# Altium project Sampling_Scope.PrjPcb (part 3 of 4)

## Sheet ECL_Fanout_X3.SchDoc
size A4; ApprovedBy: Mateusz Kowalik; CheckedBy: Mateusz Kowalik; Author: Mateusz Kowalik; CompanyName: InMotion Labs sp. z o.o.; DrawnBy: Mateusz Kowalik; Engineer: Mateusz Kowalik; Organization: InMotion Labs sp. z o.o.; Address1: Rydlówka 5A; Address2: 30-363 Kraków; Address4: Poland; DocumentNumber: 12; Revision: Rev 0; SheetNumber: 12; SheetTotal: 17
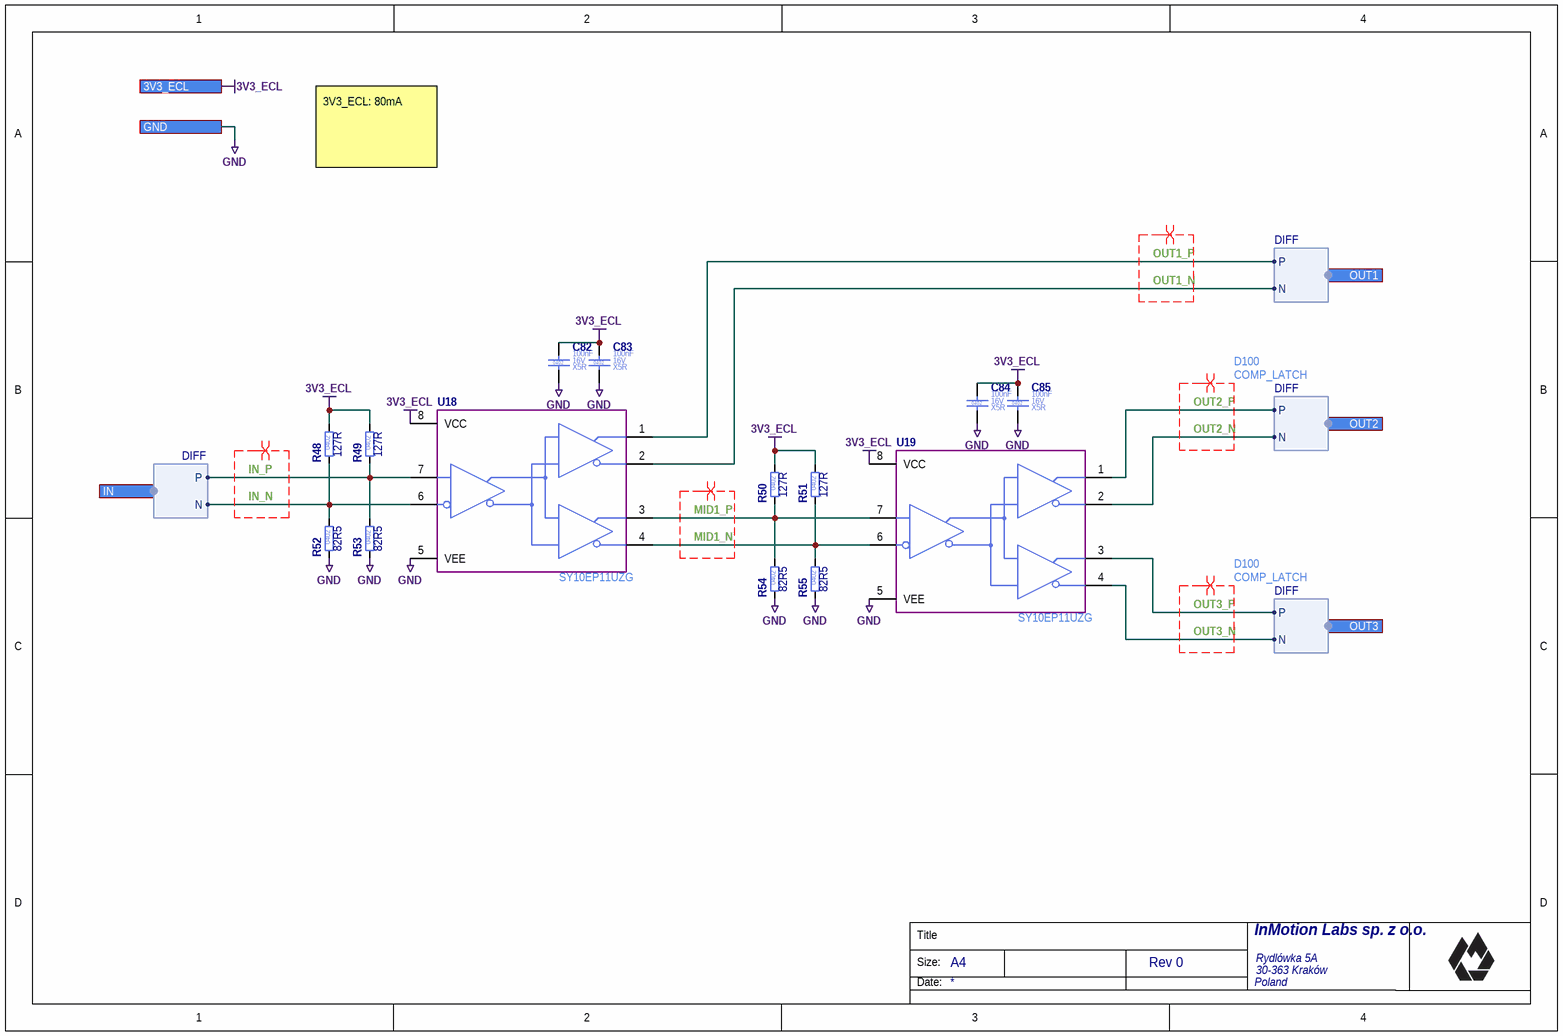
[diagram p11: ECL_Fanout_X3.SchDoc]

### Parts
C82  Case/Package: 0402  Voltage Rating (DC): 16V  Dielectric: X5R  Capacitance: 100nF  [C_0402_1005]  (hidden comment: C_100NF_16V_X5R_0402_10)
C83  Case/Package: 0402  Voltage Rating (DC): 16V  Dielectric: X5R  Capacitance: 100nF  [C_0402_1005]  (hidden comment: C_100NF_16V_X5R_0402_10)
C84  Case/Package: 0402  Voltage Rating (DC): 16V  Dielectric: X5R  Capacitance: 100nF  [C_0402_1005]  (hidden comment: C_100NF_16V_X5R_0402_10)
C85  Case/Package: 0402  Voltage Rating (DC): 16V  Dielectric: X5R  Capacitance: 100nF  [C_0402_1005]  (hidden comment: C_100NF_16V_X5R_0402_10)
R48  Resistance: 127R  Case/Package: 0402  [R_0402_1005]  (hidden comment: R_127R_0402_1)
R49  Resistance: 127R  Case/Package: 0402  [R_0402_1005]  (hidden comment: R_127R_0402_1)
R50  Resistance: 127R  Case/Package: 0402  [R_0402_1005]  (hidden comment: R_127R_0402_1)
R51  Resistance: 127R  Case/Package: 0402  [R_0402_1005]  (hidden comment: R_127R_0402_1)
R52  Resistance: 82R5  Case/Package: 0402  [R_0402_1005]  (hidden comment: R_82R5_0402_1)
R53  Resistance: 82R5  Case/Package: 0402  [R_0402_1005]  (hidden comment: R_82R5_0402_1)
R54  Resistance: 82R5  Case/Package: 0402  [R_0402_1005]  (hidden comment: R_82R5_0402_1)
R55  Resistance: 82R5  Case/Package: 0402  [R_0402_1005]  (hidden comment: R_82R5_0402_1)
U18  SY10EP11UZG  [SOIC127P600X170-8N]
U19  SY10EP11UZG  [SOIC127P600X170-8N]

### Ports
3V3_ECL, GND, IN (harness DIFF), OUT1 (harness DIFF), OUT2 (harness DIFF), OUT3 (harness DIFF)

### Harnesses
DIFF: P, N

### Nets
3V3_ECL: C82.1 C83.1 C84.1 C85.1 R48.2 R49.2 R50.2 R51.2 U18.8(VCC) U19.8(VCC) ; port 3V3_ECL
GND: C82.2 C83.2 C84.2 C85.2 R52.1 R53.1 R54.1 R55.1 U18.5(VEE) U19.5(VEE) ; port GND
IN_N: R48.1 R52.2 U18.6(~{D}) ; port IN.N  [project net DELAY_OUT1_P]
IN_P: R49.1 R53.2 U18.7(D) ; port IN.P  [project net DELAY_OUT1_N]
MID1_N: R51.1 R55.2 U18.4(~{Q1}) U19.6(~{D})  [project net MID1_N_12]
MID1_P: R50.1 R54.2 U18.3(Q1) U19.7(D)  [project net MID1_P_12]
OUT1_N: U18.2(/Q0) ; port OUT1.N
OUT1_P: U18.1(Q0) ; port OUT1.P
OUT2_N: U19.2(/Q0) ; port OUT2.N  [project net LE_N]
OUT2_P: U19.1(Q0) ; port OUT2.P  [project net LE_P]
OUT3_N: U19.4(~{Q1}) ; port OUT3.N  [project net LE_N]
OUT3_P: U19.3(Q1) ; port OUT3.P  [project net LE_P]

### Layout directives
differential pair; differential pair class D100; net class D100: IN_N, IN_P, MID1_N, MID1_P, OUT1_N, OUT1_P
differential pair; differential pair class D100; net class D100; differential pair class COMP_LATCH: OUT2_N, OUT2_P, OUT3_N, OUT3_P

### Notes on the sheet
- 3V3_ECL: 80mA
- Title
- Size:
- Date:
- A4

### Library data of the parts
C82-C85 = C_100NF_16V_X5R_0402_10: Ceramic Capacitor; Manufacturer Part Number: EMK105BJ104KV-F; Manufacturer: Taiyo Yuden; Value: 100nF; Tolerance: 10%; Part Number: C_100NF_16V_X5R_0402_10; Mount: Surface Mount; Height: 500um; HelpURL: http://datasheet.octopart.com/EMK105BJ104KV-F-Taiyo-Yuden-datasheet-8857305.pdf; RoHS: Compliant; Max Operating Temperature: 125°C; Status: MK; Supplier 1: Mouser; Supplier Part Number 1: 963-EMK105BJ104KV-F; Manufacturer 2: Samsung Electro-Mechanics; Manufacturer Part Number 2: CL05B104KO5NNNC; Supplier 2: LCSC; Supplier Part Number 2: C1525
R48-R51 = R_127R_0402_1: Thick Film Resistor; Manufacturer: Yageo; Manufacturer Part Number: RC0402FR-07127RL; Value: 127R; Tolerance: 1%; Voltage Rating (DC): 50V; Power Rating: 63mW; Stats: MK; Part Number: R_127R_0402_1; Mount: Surface Mount; Height: 350um; HelpURL: https://pl.mouser.com/datasheet/2/447/PYu_RC_Group_51_RoHS_L_10-1664068.pdf; RoHS: Compliant; Max Operating Temperature: 155°C; Supplier 1: Mouser; Supplier Part Number 1: 603-RC0402FR-07127RL; Manufacturer 2: Uniroyal Elec; Manufacturer Part Number 2: 0402WGF1270TCE; Supplier 2: LCSC; Supplier Part Number 2: C247127
R52-R55 = R_82R5_0402_1: Thick Film Resistor; Manufacturer: Yageo; Manufacturer Part Number: RC0402FR-0782R5L; Value: 82R5; Tolerance: 1%; Voltage Rating (DC): 50V; Power Rating: 63mW; Stats: MK; Part Number: R_82R5_0402_1; Mount: Surface Mount; Height: 350um; HelpURL: https://pl.mouser.com/datasheet/2/447/PYu-RC_Group_51_RoHS_L_10-1527934.pdf; RoHS: Compliant; Max Operating Temperature: 155°C; Supplier 1: Mouser; Supplier Part Number 1: 603-RC0402FR-0782R5L; Manufacturer 2: Uniroyal Elec; Manufacturer Part Number 2: 0402WGF825JTCE; Supplier 2: LCSC; Supplier Part Number 2: C52037
U18 U19 = SY10EP11UZG: 1:2 PECL Fanout Buffer; Manufacturer: Microchip; Max Output Current: 100mA; Marking: Z8-1; Max Supply Voltage: 3.6V; Min Supply Voltage: 3.0V; Part Number: SY10EP11UZG; Case/Package: SOIC8; Mount: Surface Mount; Height: 1.75mm; HelpURL: https://datasheet.octopart.com/SY10EP11UZG-Microchip-datasheet-39498.pdf; Max Operating Temperature: 85°C; RoHS: Compliant; Status: MK; Manufacturer Part Number: SY10EP11UZG; Supplier 1: Mouser; Supplier Part Number 1: 998-SY10EP11UZG

## Sheet Step_Gen.SchDoc
size A4; ApprovedBy: Mateusz Kowalik; CheckedBy: Mateusz Kowalik; Author: Mateusz Kowalik; CompanyName: InMotion Labs sp. z o.o.; DrawnBy: Mateusz Kowalik; Engineer: Mateusz Kowalik; Organization: InMotion Labs sp. z o.o.; Address1: Rydlówka 5A; Address2: 30-363 Kraków; Address4: Poland; DocumentNumber: 9; Revision: Rev 0; SheetNumber: 8; SheetTotal: 17
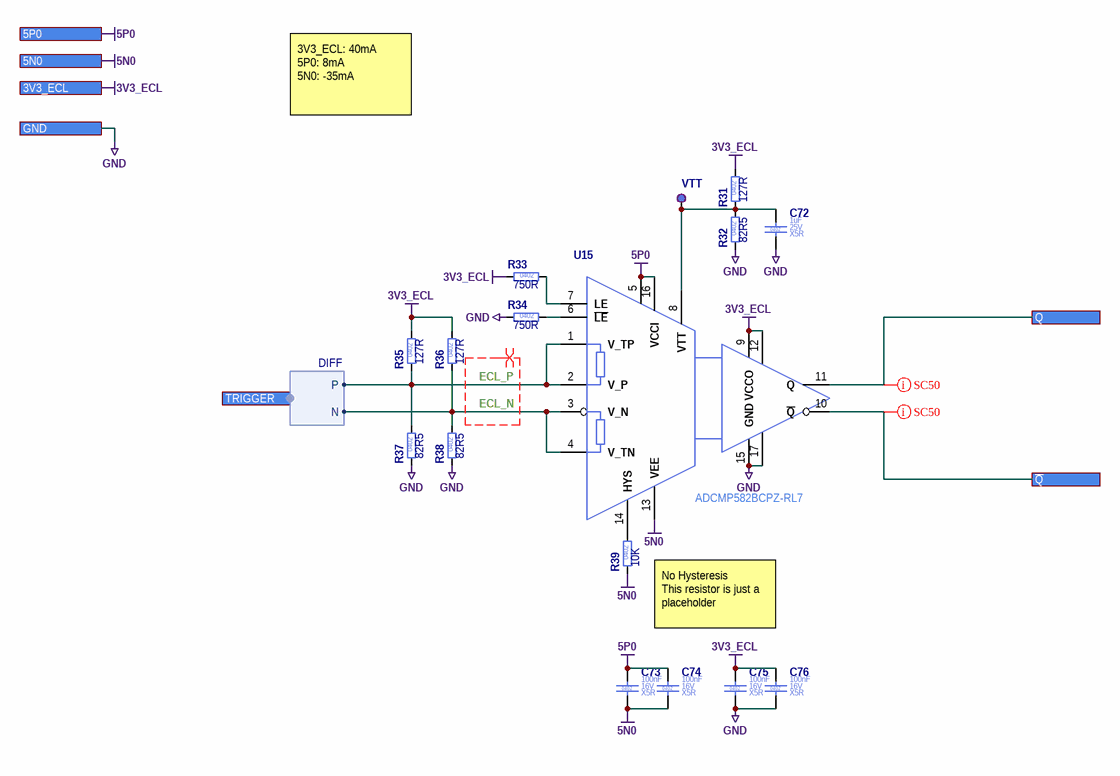
[diagram p12: Step_Gen.SchDoc]

### Parts
C72  Case/Package: 0402  Voltage Rating (DC): 25V  Dielectric: X5R  Capacitance: 1uF  [C_0402_1005]  (hidden comment: C_1UF_25V_X5R_0402_10)
C73  Case/Package: 0402  Voltage Rating (DC): 16V  Dielectric: X5R  Capacitance: 100nF  [C_0402_1005]  (hidden comment: C_100NF_16V_X5R_0402_10)
C74  Case/Package: 0402  Voltage Rating (DC): 16V  Dielectric: X5R  Capacitance: 100nF  [C_0402_1005]  (hidden comment: C_100NF_16V_X5R_0402_10)
C75  Case/Package: 0402  Voltage Rating (DC): 16V  Dielectric: X5R  Capacitance: 100nF  [C_0402_1005]  (hidden comment: C_100NF_16V_X5R_0402_10)
C76  Case/Package: 0402  Voltage Rating (DC): 16V  Dielectric: X5R  Capacitance: 100nF  [C_0402_1005]  (hidden comment: C_100NF_16V_X5R_0402_10)
R31  Resistance: 127R  Case/Package: 0402  [R_0402_1005]  (hidden comment: R_127R_0402_1)
R32  Resistance: 82R5  Case/Package: 0402  [R_0402_1005]  (hidden comment: R_82R5_0402_1)
R33  Resistance: 750R  Case/Package: 0402  [R_0402_1005]  (hidden comment: R_750R_0402_1)
R34  Resistance: 750R  Case/Package: 0402  [R_0402_1005]  (hidden comment: R_750R_0402_1)
R35  Resistance: 127R  Case/Package: 0402  [R_0402_1005]  (hidden comment: R_127R_0402_1)
R36  Resistance: 127R  Case/Package: 0402  [R_0402_1005]  (hidden comment: R_127R_0402_1)
R37  Resistance: 82R5  Case/Package: 0402  [R_0402_1005]  (hidden comment: R_82R5_0402_1)
R38  Resistance: 82R5  Case/Package: 0402  [R_0402_1005]  (hidden comment: R_82R5_0402_1)
R39  Resistance: 10K  Case/Package: 0402  [R_0402_1005]  (hidden comment: R_10K_0402_1)
U15  ADCMP582BCPZ-RL7  [QFN50P300X300X100_HS-17N]
VTT  TP_PAD_1.3MM  [TP_PAD_1.3MM]  (value not drawn)  (no BOM)

### Ports
3V3_ECL, 5N0, 5P0, GND, Q, TRIGGER (harness DIFF), ~{Q}

### Harnesses
DIFF: P, N

### Nets
3V3_ECL: C75.1 C76.1 R31.2 R33.1 R35.2 R36.2 U15.9(VCCO) U15.12(VCCO) ; port 3V3_ECL
5N0: C73.2 C74.2 R39.1 U15.13(VEE) ; port 5N0
5P0: C73.1 C74.1 U15.5(VCCI) U15.16(VCCI) ; port 5P0
GND: C72.2 C75.2 C76.2 R32.1 R34.1 R37.1 R38.1 U15.15(GND) U15.17(GND) ; port GND
ECL_N: R36.1 R38.2 U15.3(V_N) U15.4(V_TN) ; port TRIGGER.N  [project net DELAY_OUT1_N]
ECL_P: R35.1 R37.2 U15.1(V_TP) U15.2(V_P) ; port TRIGGER.P  [project net DELAY_OUT1_P]
STEP_GEN_FEED_N: U15.10(~{Q}) ; port ~{Q}
STEP_GEN_FEED_P: U15.11(Q) ; port Q
NetC72_1: C72.1 R31.1 R32.2 U15.8(VTT) VTT.1(TP)
NetR33_2: R33.2 U15.7(LE)
NetR34_2: R34.2 U15.6(~{LE})
NetR39_2: R39.2 U15.14(HYS)

### Layout directives
net class SC50: STEP_GEN_FEED_N, STEP_GEN_FEED_P
differential pair; differential pair class D100; net class D100: ECL_N, ECL_P

### Notes on the sheet
- 3V3_ECL: 40mA
  5P0: 8mA
  5N0: -35mA
- (near R39) No Hysteresis
  This resistor is just a placeholder
- Title
- Size:
- Date:
- A4

### Library data of the parts
C72 = C_1UF_25V_X5R_0402_10: Ceramic Capacitor; Manufacturer Part Number: CL05A105KA5NQNC; Manufacturer: Samsung Electro-Mechanics; Value: 1uF; Tolerance: 10%; Part Number: C_1UF_25V_X5R_0402_10; Mount: Surface Mount; Height: 550um; HelpURL: https://pl.mouser.com/datasheet/2/585/MLCC-1837944.pdf; RoHS: Compliant; Max Operating Temperature: 85°C; Status: MK; Supplier 1: Mouser; Supplier Part Number 1: 187-CL05A105KA5NQNC; Manufacturer 2: Samsung Electro-Mechanics; Manufacturer Part Number 2: CL05A105KA5NQNC; Supplier 2: LCSC; Supplier Part Number 2: C52923
C73-C76 = C_100NF_16V_X5R_0402_10: as C82 on sheet ECL_Fanout_X3; Part Number: C_100NF_16V_X5R_0402_10; Mount: Surface Mount; Height: 500um; HelpURL: http://datasheet.octopart.com/EMK105BJ104KV-F-Taiyo-Yuden-datasheet-8857305.pdf; RoHS: Compliant; Max Operating Temperature: 125°C; Status: MK; Supplier 1: Mouser; Supplier Part Number 1: 963-EMK105BJ104KV-F; Manufacturer 2: Samsung Electro-Mechanics; Manufacturer Part Number 2: CL05B104KO5NNNC; Supplier 2: LCSC; Supplier Part Number 2: C1525
R31 R35 R36 = R_127R_0402_1: as R48 on sheet ECL_Fanout_X3; Part Number: R_127R_0402_1; Mount: Surface Mount; Height: 350um; HelpURL: https://pl.mouser.com/datasheet/2/447/PYu_RC_Group_51_RoHS_L_10-1664068.pdf; RoHS: Compliant; Max Operating Temperature: 155°C; Supplier 1: Mouser; Supplier Part Number 1: 603-RC0402FR-07127RL; Manufacturer 2: Uniroyal Elec; Manufacturer Part Number 2: 0402WGF1270TCE; Supplier 2: LCSC; Supplier Part Number 2: C247127
R32 R37 R38 = R_82R5_0402_1: as R52 on sheet ECL_Fanout_X3; Part Number: R_82R5_0402_1; Mount: Surface Mount; Height: 350um; HelpURL: https://pl.mouser.com/datasheet/2/447/PYu-RC_Group_51_RoHS_L_10-1527934.pdf; RoHS: Compliant; Max Operating Temperature: 155°C; Supplier 1: Mouser; Supplier Part Number 1: 603-RC0402FR-0782R5L; Manufacturer 2: Uniroyal Elec; Manufacturer Part Number 2: 0402WGF825JTCE; Supplier 2: LCSC; Supplier Part Number 2: C52037
R33 R34 = R_750R_0402_1: Thick Film Resistor; Manufacturer: Yageo; Manufacturer Part Number: RC0402FR-07750RL; Value: 750R; Tolerance: 1%; Voltage Rating (DC): 50V; Power Rating: 63mW; Stats: MK; Part Number: R_750R_0402_1; Mount: Surface Mount; Height: 350um; HelpURL: https://pl.mouser.com/datasheet/2/447/PYu-RC_Group_51_RoHS_L_10-1664068.pdf; RoHS: Compliant; Max Operating Temperature: 155°C; Supplier 1: Mouser; Supplier Part Number 1: 603-RC0402FR-07750RL; Manufacturer 2: Uniroyal Elec; Manufacturer Part Number 2: 0402WGF7500TCE; Supplier 2: LCSC; Supplier Part Number 2: C25132
R39 = R_10K_0402_1: Thick Film Resistor; Manufacturer: Yageo; Manufacturer Part Number: RC0402FR-7W10KL; Value: 10K; Tolerance: 1%; Voltage Rating (DC): 50V; Power Rating: 63mW; Stats: MK; Part Number: R_10K_0402_1; Mount: Surface Mount; Height: 350um; HelpURL: https://pl.mouser.com/datasheet/2/447/PYu-RC_Group_51_RoHS_L_10-1664068.pdf; RoHS: Compliant; Max Operating Temperature: 155°C; Supplier 1: Mouser; Supplier Part Number 1: 603-RC0402FR-7W10KL; Manufacturer 2: Uniroyal Elec; Manufacturer Part Number 2: 0402WGF1002TCE; Supplier 2: LCSC; Supplier Part Number 2: C25744
U15 = ADCMP582BCPZ-RL7: Single Comparator; Manufacturer: Analog Devices; Number of Comparators: 1; Response Time: 180ps; Input Offset Voltage: 4mV; Marking: G10; Max Supply Voltage: 5.5V; Min Supply Voltage: 4.5V; Part Number: ADCMP582BCPZ-RL7; Manufacturer Part Number: ADCMP582BCPZ-RL7; Case/Package: QFN14; Mount: Surface Mount; Height: 0.8mm; Max Operating Temperature: 125; HelpURL: https://www.analog.com/media/en/technical-documentation/data-sheets/ADCMP580_581_582.pdf; Number of Pins: 16; RoHS: Compliant
VTT = TP_PAD_1.3MM: Testpoint SMD 1.3mm; Part Number: TP_PAD_1.3MM; Case/Package: SMD; Length: 0mm

## Sheet CMOS_MUX.SchDoc
size A4; ApprovedBy: Mateusz Kowalik; CheckedBy: Mateusz Kowalik; Author: Mateusz Kowalik; CompanyName: InMotion Labs sp. z o.o.; DrawnBy: Mateusz Kowalik; Engineer: Mateusz Kowalik; Organization: InMotion Labs sp. z o.o.; Address1: Rydlówka 5A; Address2: 30-363 Kraków; Address4: Poland; DocumentNumber: 13; Revision: Rev 0; SheetNumber: 13; SheetTotal: 17
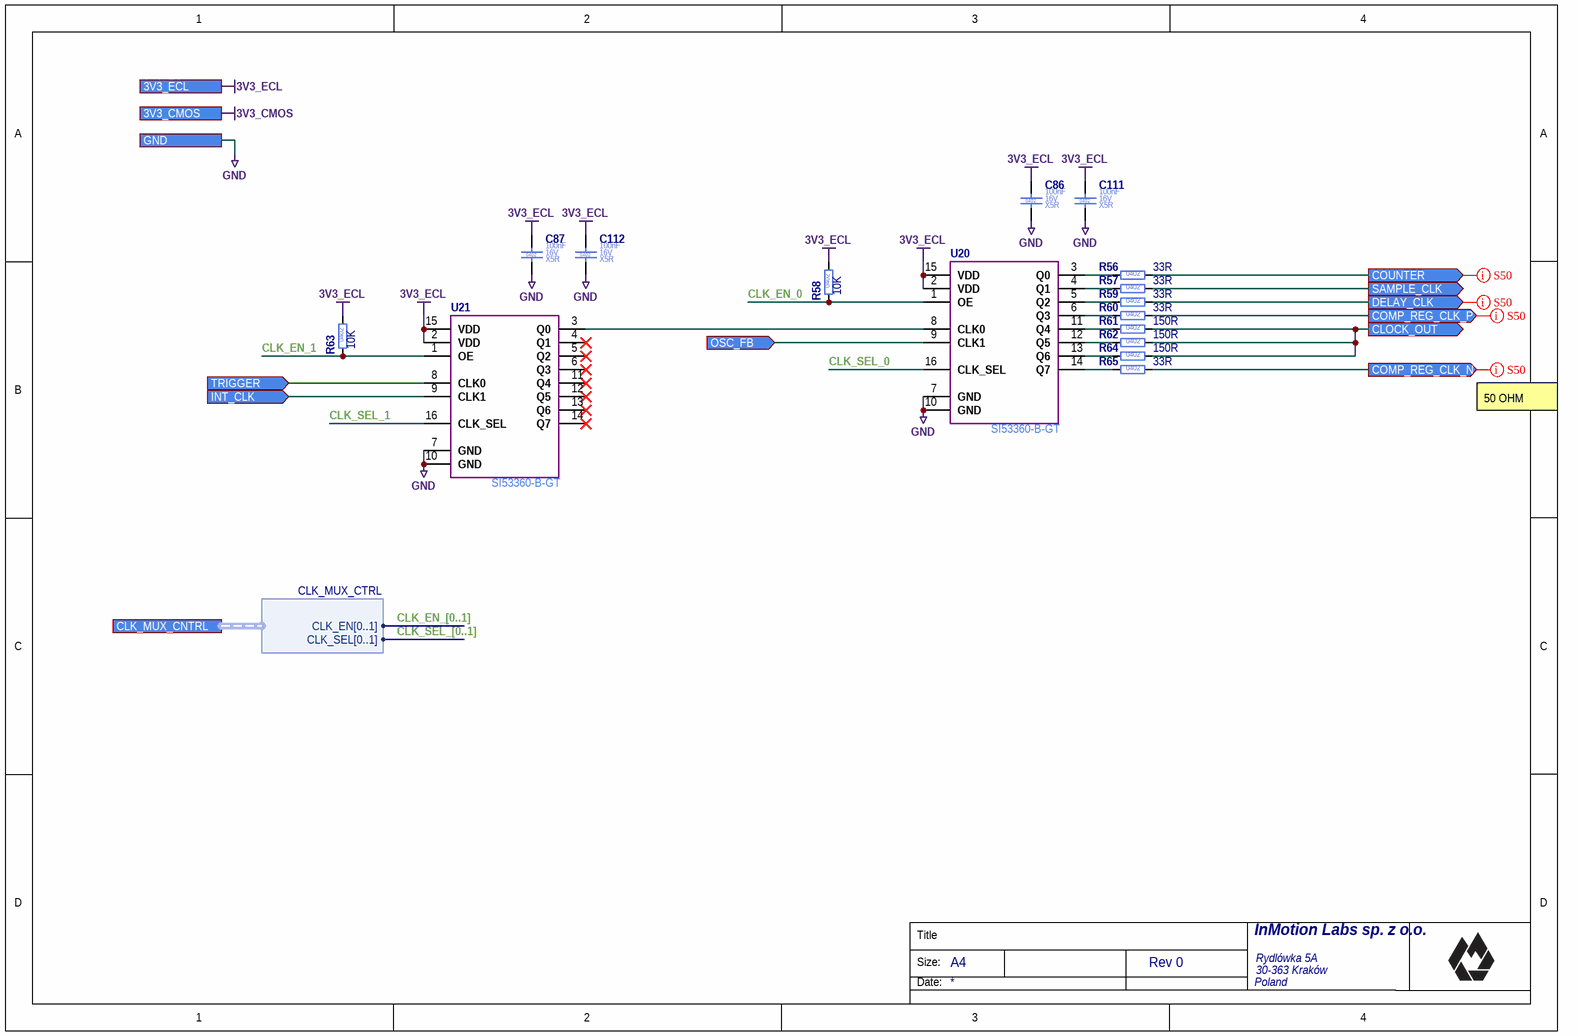
[diagram p13: CMOS_MUX.SchDoc]

### Parts
C86  Case/Package: 0402  Voltage Rating (DC): 16V  Dielectric: X5R  Capacitance: 100nF  [C_0402_1005]  (hidden comment: C_100NF_16V_X5R_0402_10)
C87  Case/Package: 0402  Voltage Rating (DC): 16V  Dielectric: X5R  Capacitance: 100nF  [C_0402_1005]  (hidden comment: C_100NF_16V_X5R_0402_10)
C111  Case/Package: 0402  Voltage Rating (DC): 16V  Dielectric: X5R  Capacitance: 100nF  [C_0402_1005]  (hidden comment: C_100NF_16V_X5R_0402_10)
C112  Case/Package: 0402  Voltage Rating (DC): 16V  Dielectric: X5R  Capacitance: 100nF  [C_0402_1005]  (hidden comment: C_100NF_16V_X5R_0402_10)
R56  Resistance: 33R  Case/Package: 0402  [R_0402_1005]  (hidden comment: R_33R_0402_1)
R57  Resistance: 33R  Case/Package: 0402  [R_0402_1005]  (hidden comment: R_33R_0402_1)
R58  Resistance: 10K  Case/Package: 0402  [R_0402_1005]  (hidden comment: R_10K_0402_1)
R59  Resistance: 33R  Case/Package: 0402  [R_0402_1005]  (hidden comment: R_33R_0402_1)
R60  Resistance: 33R  Case/Package: 0402  [R_0402_1005]  (hidden comment: R_33R_0402_1)
R61  Resistance: 150R  Case/Package: 0402  [R_0402_1005]  (hidden comment: R_150R_0402_1)
R62  Resistance: 150R  Case/Package: 0402  [R_0402_1005]  (hidden comment: R_150R_0402_1)
R63  Resistance: 10K  Case/Package: 0402  [R_0402_1005]  (hidden comment: R_10K_0402_1)
R64  Resistance: 150R  Case/Package: 0402  [R_0402_1005]  (hidden comment: R_150R_0402_1)
R65  Resistance: 33R  Case/Package: 0402  [R_0402_1005]  (hidden comment: R_33R_0402_1)
U20  Si53360-B-GT  [TSOP65P640X120-16N]
U21  Si53360-B-GT  [TSOP65P640X120-16N]

### Ports
3V3_CMOS, 3V3_ECL, CLK_MUX_CNTRL (harness CLK_MUX_CTRL), CLOCK_OUT (out), COMP_REG_CLK_N (out), COMP_REG_CLK_P (out), COUNTER (out), DELAY_CLK (out), GND, INT_CLK (in), OSC_FB (in), SAMPLE_CLK (out), TRIGGER (in)

### Harnesses
CLK_MUX_CTRL: CLK_SEL[0..1], CLK_EN[0..1]

### Nets
3V3_ECL: C86.1 C87.1 C111.1 C112.1 R58.2 R63.2 U20.2(VDD) U20.15(VDD) U21.2(VDD) U21.15(VDD) ; port 3V3_ECL
GND: C86.2 C87.2 C111.2 C112.2 U20.7(GND) U20.10(GND) U21.7(GND) U21.10(GND) ; port GND
CLK_EN_0: R58.1 U20.1(OE)
CLK_EN_1: R63.1 U21.1(OE)
CLK_OUT: R61.2 R62.2 R64.2 ; port CLOCK_OUT
CLK_SEL_0: U20.16(CLK_SEL)
CLK_SEL_1: U21.16(CLK_SEL)
COMP_REG_CLK_N: R65.2 ; port COMP_REG_CLK_N
COMP_REG_CLK_P: R60.2 ; port COMP_REG_CLK_P
COUNTER: R56.2 ; port COUNTER
DELAY_CLK: R59.2 ; port DELAY_CLK
INT_CLK: U21.9(CLK1) ; port INT_CLK
OSC_FB: U20.9(CLK1) ; port OSC_FB
SAMPLE_CLK: R57.2 ; port SAMPLE_CLK
TRIGGER_IN: U21.8(CLK0) ; port TRIGGER
NetR56_1: R56.1 U20.3(Q0)
NetR57_1: R57.1 U20.4(Q1)
NetR59_1: R59.1 U20.5(Q2)
NetR60_1: R60.1 U20.6(Q3)
NetR61_1: R61.1 U20.11(Q4)
NetR62_1: R62.1 U20.12(Q5)
NetR64_1: R64.1 U20.13(Q6)
NetR65_1: R65.1 U20.14(Q7)
NetU20_8: U20.8(CLK0) U21.3(Q0)

Not connected (* = marked no-connect by the designer): U21 4(Q1)* 5(Q2)* 6(Q3)* 11(Q4)* 12(Q5)* 13(Q6)* 14(Q7)*

### Buses and harness runs
bus CLK_EN_[0..1]
bus CLK_SEL_[0..1]

### Layout directives
net class S50: COMP_REG_CLK_N, COMP_REG_CLK_P, COUNTER, DELAY_CLK

### Notes on the sheet
- 50 OHM
- Title
- Size:
- Date:
- A4

### Library data of the parts
C86 C87 C111 C112 = C_100NF_16V_X5R_0402_10: as C82 on sheet ECL_Fanout_X3; Part Number: C_100NF_16V_X5R_0402_10; Mount: Surface Mount; Height: 500um; HelpURL: http://datasheet.octopart.com/EMK105BJ104KV-F-Taiyo-Yuden-datasheet-8857305.pdf; RoHS: Compliant; Max Operating Temperature: 125°C; Status: MK; Supplier 1: Mouser; Supplier Part Number 1: 963-EMK105BJ104KV-F; Manufacturer 2: Samsung Electro-Mechanics; Manufacturer Part Number 2: CL05B104KO5NNNC; Supplier 2: LCSC; Supplier Part Number 2: C1525
R56 R57 R59 R60 R65 = R_33R_0402_1: Thick Film Resistor; Manufacturer: Yageo; Manufacturer Part Number: RC0402FR-0733RL; Value: 33R; Tolerance: 1%; Voltage Rating (DC): 50V; Power Rating: 63mW; Stats: MK; Part Number: R_33R_0402_1; Mount: Surface Mount; Height: 350um; HelpURL: https://pl.mouser.com/datasheet/2/447/PYu-RC_Group_51_RoHS_L_10-1527934.pdf; RoHS: Compliant; Max Operating Temperature: 155°C; Supplier 1: Mouser; Supplier Part Number 1: 603-RC0402FR-0733RL; Manufacturer 2: Uniroyal Elec; Manufacturer Part Number 2: 0402WGF330JTCE; Supplier 2: LCSC; Supplier Part Number 2: C25105
R58 R63 = R_10K_0402_1: as R39 on sheet Step_Gen; Part Number: R_10K_0402_1; Mount: Surface Mount; Height: 350um; HelpURL: https://pl.mouser.com/datasheet/2/447/PYu-RC_Group_51_RoHS_L_10-1664068.pdf; RoHS: Compliant; Max Operating Temperature: 155°C; Supplier 1: Mouser; Supplier Part Number 1: 603-RC0402FR-7W10KL; Manufacturer 2: Uniroyal Elec; Manufacturer Part Number 2: 0402WGF1002TCE; Supplier 2: LCSC; Supplier Part Number 2: C25744
R61 R62 R64 = R_150R_0402_1: Thick Film Resistor; Manufacturer: Yageo; Manufacturer Part Number: RC0402FR-07150RL; Value: 150R; Tolerance: 1%; Voltage Rating (DC): 50V; Power Rating: 63mW; Stats: MK; Part Number: R_150R_0402_1; Mount: Surface Mount; Height: 350um; HelpURL: http://datasheet.octopart.com/RC0402FR-07150RL-Yageo-datasheet-10408619.pdf; RoHS: Compliant; Max Operating Temperature: 155°C; Supplier 1: Mouser; Supplier Part Number 1: 603-RC0402FR-07150RL; Manufacturer 2: Uniroyal Elec; Manufacturer Part Number 2: 0402WGF1500TCE; Supplier 2: LCSC; Supplier Part Number 2: C25082
U20 U21 = Si53360-B-GT: Low Jitter Clock Buffer; Manufacturer: Silicon Labs; Max Frequency: 200MHz; Max Supply Voltage: 3.6V; Min Supply Voltage: 2.25V; Part Number: Si53360-B-GT; Case/Package: TSSOP16; Mount: Surface Mount; Height: 1.2mm; HelpURL: https://pl.mouser.com/datasheet/2/368/Si5336x-datasheet-1397964.pdf; Logic Function: Clock Buffer; Marking: Si53360; Max Operating Temperature: 85°C; RoHS: Compliant; Status: MK; Manufacturer Part Number: SI53360-B-GT; Supplier 1: Mouser; Supplier Part Number 1: 634-SI53360-B-GT

## Sheet Counter.SchDoc
size A4; ApprovedBy: Mateusz Kowalik; CheckedBy: Mateusz Kowalik; Author: Mateusz Kowalik; CompanyName: InMotion Labs sp. z o.o.; DrawnBy: Mateusz Kowalik; Engineer: Mateusz Kowalik; Organization: InMotion Labs sp. z o.o.; Address1: Rydlówka 5A; Address2: 30-363 Kraków; Address4: Poland; DocumentNumber: 14; Revision: Rev 0; SheetNumber: 14; SheetTotal: 17
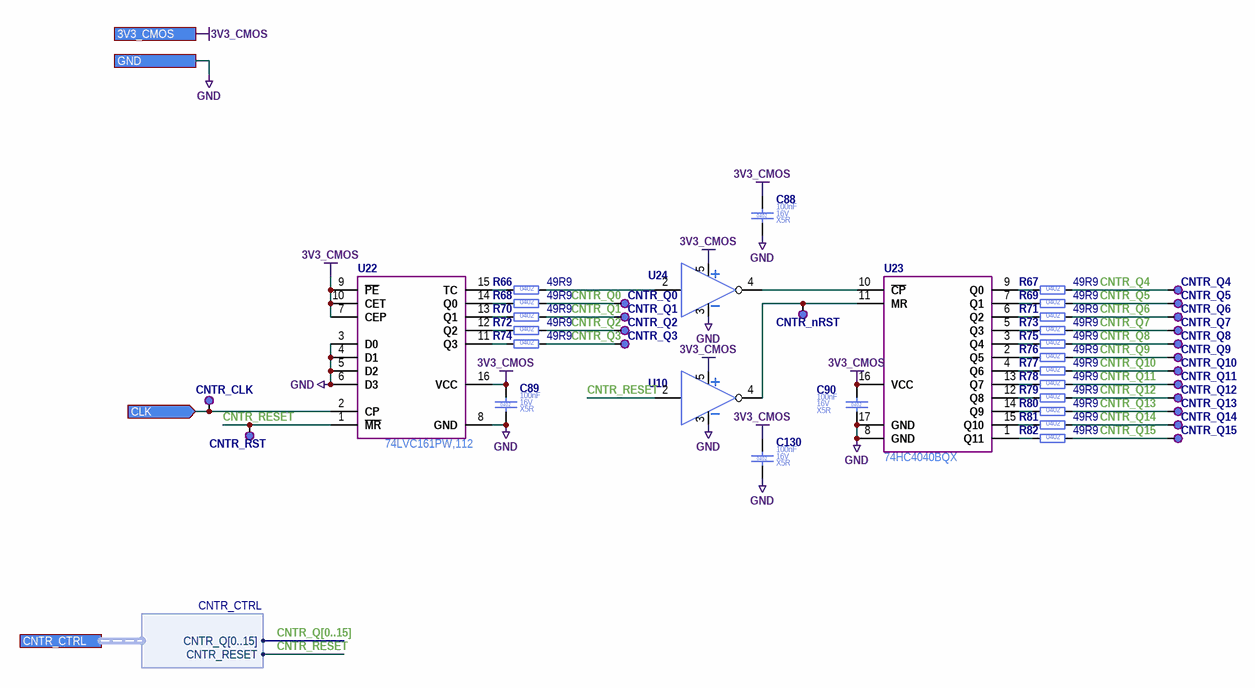
[diagram p14: Counter.SchDoc]

### Parts
C88  Case/Package: 0402  Voltage Rating (DC): 16V  Dielectric: X5R  Capacitance: 100nF  [C_0402_1005]  (hidden comment: C_100NF_16V_X5R_0402_10)
C89  Case/Package: 0402  Voltage Rating (DC): 16V  Dielectric: X5R  Capacitance: 100nF  [C_0402_1005]  (hidden comment: C_100NF_16V_X5R_0402_10)
C90  Case/Package: 0402  Voltage Rating (DC): 16V  Dielectric: X5R  Capacitance: 100nF  [C_0402_1005]  (hidden comment: C_100NF_16V_X5R_0402_10)
C130  Case/Package: 0402  Voltage Rating (DC): 16V  Dielectric: X5R  Capacitance: 100nF  [C_0402_1005]  (hidden comment: C_100NF_16V_X5R_0402_10)
CNTR_CLK  TP_PAD_1.3MM  [TP_PAD_1.3MM]  (value not drawn)  (no BOM)
CNTR_nRST  TP_PAD_1.3MM  [TP_PAD_1.3MM]  (value not drawn)  (no BOM)
CNTR_Q0  TP_PAD_1.3MM  [TP_PAD_1.3MM]  (value not drawn)  (no BOM)
CNTR_Q1  TP_PAD_1.3MM  [TP_PAD_1.3MM]  (value not drawn)  (no BOM)
CNTR_Q2  TP_PAD_1.3MM  [TP_PAD_1.3MM]  (value not drawn)  (no BOM)
CNTR_Q3  TP_PAD_1.3MM  [TP_PAD_1.3MM]  (value not drawn)  (no BOM)
CNTR_Q4  TP_PAD_1.3MM  [TP_PAD_1.3MM]  (value not drawn)  (no BOM)
CNTR_Q5  TP_PAD_1.3MM  [TP_PAD_1.3MM]  (value not drawn)  (no BOM)
CNTR_Q6  TP_PAD_1.3MM  [TP_PAD_1.3MM]  (value not drawn)  (no BOM)
CNTR_Q7  TP_PAD_1.3MM  [TP_PAD_1.3MM]  (value not drawn)  (no BOM)
CNTR_Q8  TP_PAD_1.3MM  [TP_PAD_1.3MM]  (value not drawn)  (no BOM)
CNTR_Q9  TP_PAD_1.3MM  [TP_PAD_1.3MM]  (value not drawn)  (no BOM)
CNTR_Q10  TP_PAD_1.3MM  [TP_PAD_1.3MM]  (value not drawn)  (no BOM)
CNTR_Q11  TP_PAD_1.3MM  [TP_PAD_1.3MM]  (value not drawn)  (no BOM)
CNTR_Q12  TP_PAD_1.3MM  [TP_PAD_1.3MM]  (value not drawn)  (no BOM)
CNTR_Q13  TP_PAD_1.3MM  [TP_PAD_1.3MM]  (value not drawn)  (no BOM)
CNTR_Q14  TP_PAD_1.3MM  [TP_PAD_1.3MM]  (value not drawn)  (no BOM)
CNTR_Q15  TP_PAD_1.3MM  [TP_PAD_1.3MM]  (value not drawn)  (no BOM)
CNTR_RST  TP_PAD_1.3MM  [TP_PAD_1.3MM]  (value not drawn)  (no BOM)
R66  Resistance: 49R9  Case/Package: 0402  [R_0402_1005]  (hidden comment: R_49R9_0402_1)
R67  Resistance: 49R9  Case/Package: 0402  [R_0402_1005]  (hidden comment: R_49R9_0402_1)
R68  Resistance: 49R9  Case/Package: 0402  [R_0402_1005]  (hidden comment: R_49R9_0402_1)
R69  Resistance: 49R9  Case/Package: 0402  [R_0402_1005]  (hidden comment: R_49R9_0402_1)
R70  Resistance: 49R9  Case/Package: 0402  [R_0402_1005]  (hidden comment: R_49R9_0402_1)
R71  Resistance: 49R9  Case/Package: 0402  [R_0402_1005]  (hidden comment: R_49R9_0402_1)
R72  Resistance: 49R9  Case/Package: 0402  [R_0402_1005]  (hidden comment: R_49R9_0402_1)
R73  Resistance: 49R9  Case/Package: 0402  [R_0402_1005]  (hidden comment: R_49R9_0402_1)
R74  Resistance: 49R9  Case/Package: 0402  [R_0402_1005]  (hidden comment: R_49R9_0402_1)
R75  Resistance: 49R9  Case/Package: 0402  [R_0402_1005]  (hidden comment: R_49R9_0402_1)
R76  Resistance: 49R9  Case/Package: 0402  [R_0402_1005]  (hidden comment: R_49R9_0402_1)
R77  Resistance: 49R9  Case/Package: 0402  [R_0402_1005]  (hidden comment: R_49R9_0402_1)
R78  Resistance: 49R9  Case/Package: 0402  [R_0402_1005]  (hidden comment: R_49R9_0402_1)
R79  Resistance: 49R9  Case/Package: 0402  [R_0402_1005]  (hidden comment: R_49R9_0402_1)
R80  Resistance: 49R9  Case/Package: 0402  [R_0402_1005]  (hidden comment: R_49R9_0402_1)
R81  Resistance: 49R9  Case/Package: 0402  [R_0402_1005]  (hidden comment: R_49R9_0402_1)
R82  Resistance: 49R9  Case/Package: 0402  [R_0402_1005]  (hidden comment: R_49R9_0402_1)
U10  SN74AHC1G04DBVR  [SOT23-5_SC74A_SOT753_M]  (value not drawn)
U22  74LVC161PW,112  [TSOP65P640X120-16N]
U23  74HC4040BQX  [QFN50P350X250X100_HS-17N]
U24  SN74AHC1G04DBVR  [SOT23-5_SC74A_SOT753_M]  (value not drawn)

### Ports
3V3_CMOS, CLK (in), CNTR_CTRL (harness CNTR_CTRL), GND

### Harnesses
CNTR_CTRL: CNTR_Q[0..15], CNTR_RESET

### Nets
3V3_CMOS: C88.1 C89.1 C90.1 C130.1 U10.5(VCC) U22.7(CEP) U22.9(~{PE}) U22.10(CET) U22.16(VCC) U23.16(VCC) U24.5(VCC) ; port 3V3_CMOS
GND: C88.2 C89.2 C90.2 C130.2 U10.3(GND) U22.3(D0) U22.4(D1) U22.5(D2) U22.6(D3) U22.8(GND) U23.8(GND) U23.17(GND) U24.3(GND) ; port GND
CNTR_Q0: CNTR_Q0.1(TP) R68.2
CNTR_Q1: CNTR_Q1.1(TP) R70.2
CNTR_Q2: CNTR_Q2.1(TP) R72.2
CNTR_Q3: CNTR_Q3.1(TP) R74.2
CNTR_Q4: CNTR_Q4.1(TP) R67.2
CNTR_Q5: CNTR_Q5.1(TP) R69.2
CNTR_Q6: CNTR_Q6.1(TP) R71.2
CNTR_Q7: CNTR_Q7.1(TP) R73.2
CNTR_Q8: CNTR_Q8.1(TP) R75.2
CNTR_Q9: CNTR_Q9.1(TP) R76.2
CNTR_Q10: CNTR_Q10.1(TP) R77.2
CNTR_Q11: CNTR_Q11.1(TP) R78.2
CNTR_Q12: CNTR_Q12.1(TP) R79.2
CNTR_Q13: CNTR_Q13.1(TP) R80.2
CNTR_Q14: CNTR_Q14.1(TP) R81.2
CNTR_Q15: CNTR_Q15.1(TP) R82.2
CNTR_RESET: CNTR_RST.1(TP) U10.2 U22.1(~{MR}) ; port CNTR_CTRL.CNTR_RESET  [project net CNTR_CTRL.CNTR_RESET]
COUNTER: CNTR_CLK.1(TP) U22.2(CP) ; port CLK
NetCNTR_nRST_1: CNTR_nRST.1(TP) U10.4(OutY) U23.11(MR)
NetR66_1: R66.1 U22.15(TC)
NetR66_2: R66.2 U24.2
NetR67_1: R67.1 U23.9(Q0)
NetR68_1: R68.1 U22.14(Q0)
NetR69_1: R69.1 U23.7(Q1)
NetR70_1: R70.1 U22.13(Q1)
NetR71_1: R71.1 U23.6(Q2)
NetR72_1: R72.1 U22.12(Q2)
NetR73_1: R73.1 U23.5(Q3)
NetR74_1: R74.1 U22.11(Q3)
NetR75_1: R75.1 U23.3(Q4)
NetR76_1: R76.1 U23.2(Q5)
NetR77_1: R77.1 U23.4(Q6)
NetR78_1: R78.1 U23.13(Q7)
NetR79_1: R79.1 U23.12(Q8)
NetR80_1: R80.1 U23.14(Q9)
NetR81_1: R81.1 U23.15(Q10)
NetR82_1: R82.1 U23.1(Q11)
NetU23_10: U23.10(~{CP}) U24.4(OutY)

Not connected (* = marked no-connect by the designer): U10 1(NC); U24 1(NC)

### Buses and harness runs
bus CNTR_Q[0..15]

### Notes on the sheet
- Title
- Size:
- Date:
- A4

### Library data of the parts
C88-C90 C130 = C_100NF_16V_X5R_0402_10: as C82 on sheet ECL_Fanout_X3; Part Number: C_100NF_16V_X5R_0402_10; Mount: Surface Mount; Height: 500um; HelpURL: http://datasheet.octopart.com/EMK105BJ104KV-F-Taiyo-Yuden-datasheet-8857305.pdf; RoHS: Compliant; Max Operating Temperature: 125°C; Status: MK; Supplier 1: Mouser; Supplier Part Number 1: 963-EMK105BJ104KV-F; Manufacturer 2: Samsung Electro-Mechanics; Manufacturer Part Number 2: CL05B104KO5NNNC; Supplier 2: LCSC; Supplier Part Number 2: C1525
CNTR_CLK CNTR_nRST CNTR_Q0-CNTR_Q15 CNTR_RST = TP_PAD_1.3MM: Testpoint SMD 1.3mm; Part Number: TP_PAD_1.3MM; Case/Package: SMD; Length: 0mm
R66-R82 = R_49R9_0402_1: Thick Film Resistor; Manufacturer: Yageo; Manufacturer Part Number: RC0402FR-0749R9L; Value: 49R9; Tolerance: 1%; Voltage Rating (DC): 50V; Power Rating: 63mW; Stats: MK; Part Number: R_49R9_0402_1; Mount: Surface Mount; Height: 350um; HelpURL: https://pl.mouser.com/datasheet/2/447/PYu_RC_Group_51_RoHS_L_10-1664068.pdf; RoHS: Compliant; Max Operating Temperature: 155°C; Supplier 1: Mouser; Supplier Part Number 1: 603-RC0402FR-0749R9L; Manufacturer 2: Uniroyal Elec; Manufacturer Part Number 2: 0402WGF499JTCE; Supplier 2: LCSC; Supplier Part Number 2: C25120
U10 U24 = SN74AHC1G04DBVR: Inverters Single; Manufacturer: Texas Instruments; Output Current: 25mA; Max Output Current: 50mA; Max Supply Voltage: 5.5V; Min Supply Voltage: 2V; Part Number: SN74AHC1G04DBVR; Case/Package: SOT-23; Mount: Surface Mount; Height: 1.1mm; HelpURL: http://www.ti.com/lit/ds/symlink/sn74ahc1g04.pdf; Max Operating Temperature: 125°C; RoHS: Compliant; Status: AK; Manufacturer Part Number: SN74AHC1G04DBVR
U22 = 74LVC161PW,112: 4 bit Counter with preset; Manufacturer: Nexperia; Output Current: 50mA; Max Supply Voltage: 3.6V; Min Supply Voltage: 1.65V; Part Number: 74LVC161PW,112; Case/Package: TSSOP16; Max Output Current: 50mA; Mount: Surface Mount; Height: 1.1mm; HelpURL: https://pl.mouser.com/datasheet/2/916/74LVC161-1319465.pdf; Max Operating Temperature: 125°C; RoHS: Compliant; Status: MK; Manufacturer Part Number: 74LVC161PW,112; Supplier 1: Mouser; Supplier Part Number 1: 771-LVC161PW112
U23 = 74HC4040BQX: 12 bit binary ripple counter; Manufacturer: Nexperia; Output Current: 25mA; Max Supply Voltage: 5.5V; Min Supply Voltage: 2.7V; Manufacturer Part Number: 74HC4040BQX; Part Number: 74HC4040BQX; Case/Package: DHVQFN16; Max Output Current: 25mA; Mount: Surface Mount; Height: 1mm; HelpURL: https://pl.mouser.com/datasheet/2/916/74HC_HCT4040-1319793.pdf; Max Operating Temperature: 125°C; RoHS: Compliant; Status: MK; Supplier 1: Mouser; Supplier Part Number 1: 771-74HC4040BQX

## Sheet Thermal_MGMT.SchDoc
size A4; ApprovedBy: Mateusz Kowalik; CheckedBy: Mateusz Kowalik; Author: Mateusz Kowalik; CompanyName: InMotion Labs sp. z o.o.; DrawnBy: Mateusz Kowalik; Engineer: Mateusz Kowalik; Organization: InMotion Labs sp. z o.o.; Address1: Rydlówka 5A; Address2: 30-363 Kraków; Address4: Poland; DocumentNumber: 15; Revision: Rev 0; SheetNumber: 15; SheetTotal: 17
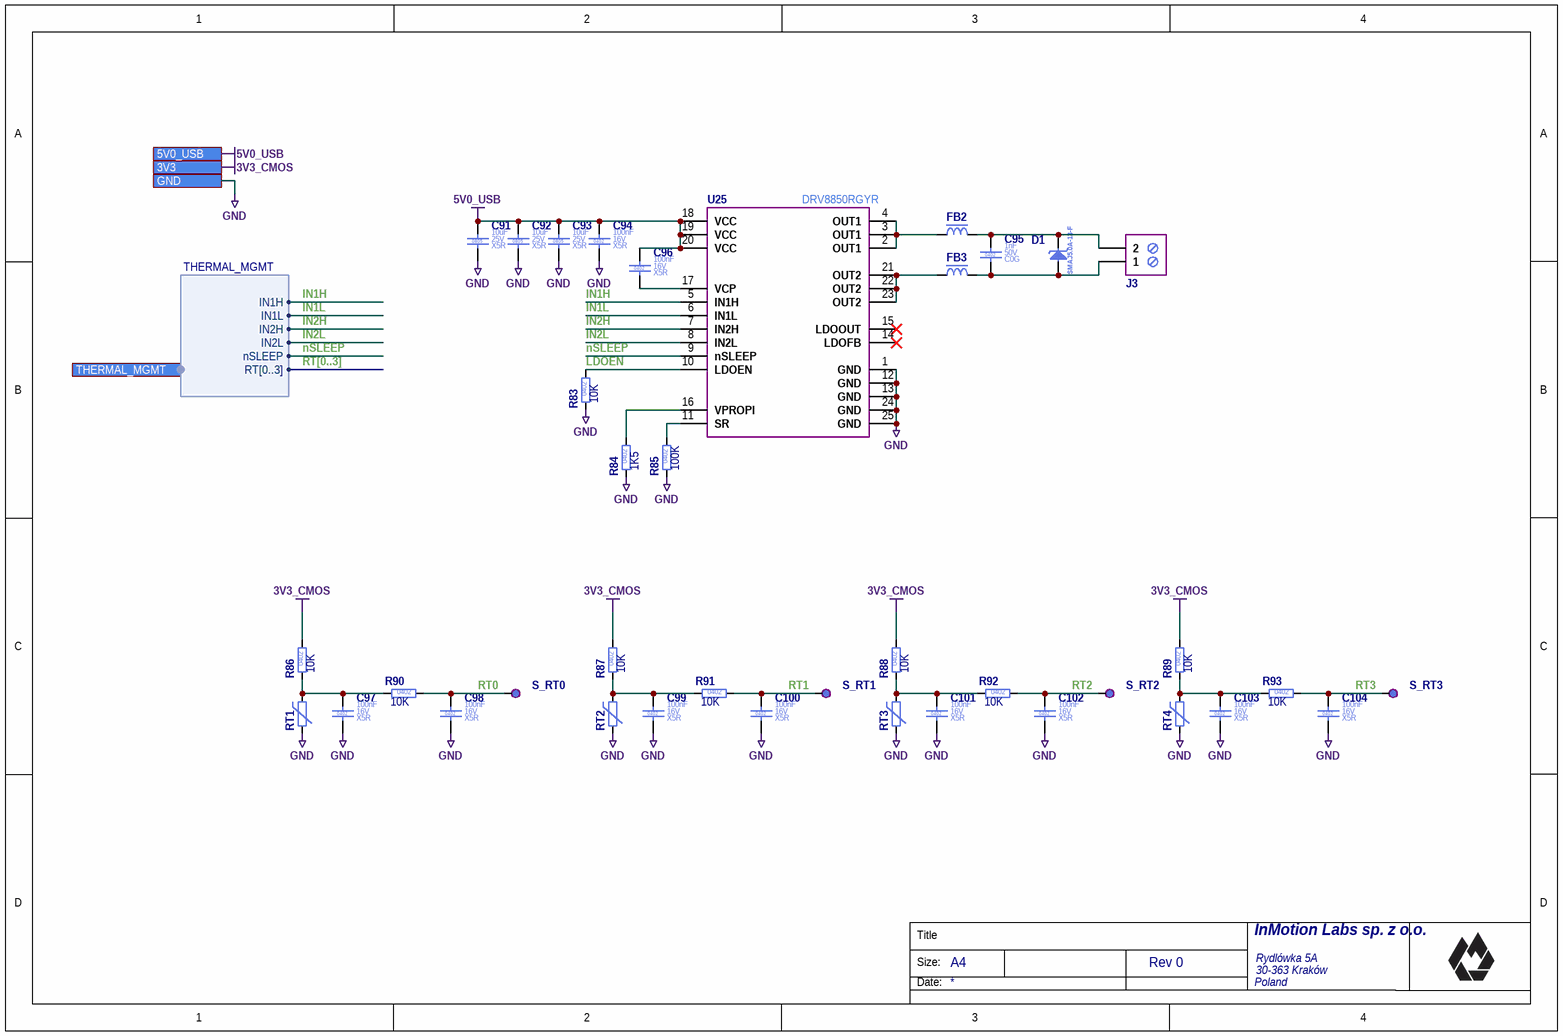
[diagram p15: Thermal_MGMT.SchDoc]

### Parts
C91  Case/Package: 0805  Voltage Rating (DC): 25V  Dielectric: X5R  Capacitance: 10uF  [C_0805_2012]  (hidden comment: C_10UF_25V_X5R_0805_10)
C92  Case/Package: 0805  Voltage Rating (DC): 25V  Dielectric: X5R  Capacitance: 10uF  [C_0805_2012]  (hidden comment: C_10UF_25V_X5R_0805_10)
C93  Case/Package: 0805  Voltage Rating (DC): 25V  Dielectric: X5R  Capacitance: 10uF  [C_0805_2012]  (hidden comment: C_10UF_25V_X5R_0805_10)
C94  Case/Package: 0402  Voltage Rating (DC): 16V  Dielectric: X5R  Capacitance: 100nF  [C_0402_1005]  (hidden comment: C_100NF_16V_X5R_0402_10)
C95  Case/Package: 0402  Voltage Rating (DC): 50V  Dielectric: C0G  Capacitance: 1nF  [C_0402_1005]  (hidden comment: C_1NF_50V_C0G_0402_5)
C96  Case/Package: 0402  Voltage Rating (DC): 16V  Dielectric: X5R  Capacitance: 100nF  [C_0402_1005]  (hidden comment: C_100NF_16V_X5R_0402_10)
C97  Case/Package: 0402  Voltage Rating (DC): 16V  Dielectric: X5R  Capacitance: 100nF  [C_0402_1005]  (hidden comment: C_100NF_16V_X5R_0402_10)
C98  Case/Package: 0402  Voltage Rating (DC): 16V  Dielectric: X5R  Capacitance: 100nF  [C_0402_1005]  (hidden comment: C_100NF_16V_X5R_0402_10)
C99  Case/Package: 0402  Voltage Rating (DC): 16V  Dielectric: X5R  Capacitance: 100nF  [C_0402_1005]  (hidden comment: C_100NF_16V_X5R_0402_10)
C100  Case/Package: 0402  Voltage Rating (DC): 16V  Dielectric: X5R  Capacitance: 100nF  [C_0402_1005]  (hidden comment: C_100NF_16V_X5R_0402_10)
C101  Case/Package: 0402  Voltage Rating (DC): 16V  Dielectric: X5R  Capacitance: 100nF  [C_0402_1005]  (hidden comment: C_100NF_16V_X5R_0402_10)
C102  Case/Package: 0402  Voltage Rating (DC): 16V  Dielectric: X5R  Capacitance: 100nF  [C_0402_1005]  (hidden comment: C_100NF_16V_X5R_0402_10)
C103  Case/Package: 0402  Voltage Rating (DC): 16V  Dielectric: X5R  Capacitance: 100nF  [C_0402_1005]  (hidden comment: C_100NF_16V_X5R_0402_10)
C104  Case/Package: 0402  Voltage Rating (DC): 16V  Dielectric: X5R  Capacitance: 100nF  [C_0402_1005]  (hidden comment: C_100NF_16V_X5R_0402_10)
D1  SMAJ5.0A-13-F  [DO-214AC]
FB2  FBMJ1608HS220NTR  [FB_0603_1608]  (value not drawn)
FB3  FBMJ1608HS220NTR  [FB_0603_1608]  (value not drawn)
J3  691101710002  [691101710002]  (value not drawn)
R83  Resistance: 10K  Case/Package: 0402  [R_0402_1005]  (hidden comment: R_10K_0402_1)
R84  Resistance: 1K5  Case/Package: 0402  [R_0402_1005]  (hidden comment: R_1K5_0402_1)
R85  Resistance: 100K  Case/Package: 0402  [R_0402_1005]  (hidden comment: R_100K_0402_1)
R86  Resistance: 10K  Case/Package: 0402  [R_0402_1005]  (hidden comment: R_10K_0402_1)
R87  Resistance: 10K  Case/Package: 0402  [R_0402_1005]  (hidden comment: R_10K_0402_1)
R88  Resistance: 10K  Case/Package: 0402  [R_0402_1005]  (hidden comment: R_10K_0402_1)
R89  Resistance: 10K  Case/Package: 0402  [R_0402_1005]  (hidden comment: R_10K_0402_1)
R90  Resistance: 10K  Case/Package: 0402  [R_0402_1005]  (hidden comment: R_10K_0402_1)
R91  Resistance: 10K  Case/Package: 0402  [R_0402_1005]  (hidden comment: R_10K_0402_1)
R92  Resistance: 10K  Case/Package: 0402  [R_0402_1005]  (hidden comment: R_10K_0402_1)
R93  Resistance: 10K  Case/Package: 0402  [R_0402_1005]  (hidden comment: R_10K_0402_1)
RT1  NCP15XH103J03RC  [R_0402_1005]  (value not drawn)
RT2  NCP15XH103J03RC  [R_0402_1005]  (value not drawn)
RT3  NCP15XH103J03RC  [R_0402_1005]  (value not drawn)
RT4  NCP15XH103J03RC  [R_0402_1005]  (value not drawn)
S_RT0  TP_PAD_1.3MM  [TP_PAD_1.3MM]  (value not drawn)  (no BOM)
S_RT1  TP_PAD_1.3MM  [TP_PAD_1.3MM]  (value not drawn)  (no BOM)
S_RT2  TP_PAD_1.3MM  [TP_PAD_1.3MM]  (value not drawn)  (no BOM)
S_RT3  TP_PAD_1.3MM  [TP_PAD_1.3MM]  (value not drawn)  (no BOM)
U25  DRV8850RGYR  [PQFN50P350X550X100_HS-25N]

### Ports
3V3, 5V0_USB, GND, THERMAL_MGMT (harness THERMAL_MGMT)

### Harnesses
THERMAL_MGMT: RT[0..3], nSLEEP, IN2L, IN2H, IN1L, IN1H

### Nets
3V3_CMOS: R86.2 R87.2 R88.2 R89.2 ; port 3V3
5V0_USB: C91.1 C92.1 C93.1 C94.1 C96.1 U25.18(VCC) U25.19(VCC) U25.20(VCC) ; port 5V0_USB
GND: C91.2 C92.2 C93.2 C94.2 C97.2 C98.2 C99.2 C100.2 C101.2 C102.2 C103.2 C104.2 R83.1 R84.1 R85.1 RT1.1 RT2.1 RT3.1 RT4.1 U25.1(GND) U25.12(GND) U25.13(GND) U25.24(GND) U25.25(GND) ; port GND
IN1H: U25.5(IN1H) ; port THERMAL_MGMT.IN1H  [project net THERMAL_MGMT.IN1H]
IN1L: U25.6(IN1L) ; port THERMAL_MGMT.IN1L  [project net THERMAL_MGMT.IN1L]
IN2H: U25.7(IN2H) ; port THERMAL_MGMT.IN2H  [project net THERMAL_MGMT.IN2H]
IN2L: U25.8(IN2L) ; port THERMAL_MGMT.IN2L  [project net THERMAL_MGMT.IN2L]
LDOEN: R83.2 U25.10(LDOEN)  [project net LDOEN_15]
nSLEEP: U25.9(nSLEEP) ; port THERMAL_MGMT.nSLEEP  [project net THERMAL_MGMT.nSLEEP]
RT0: C98.1 R90.2 S_RT0.1(TP)
RT1: C100.1 R91.2 S_RT1.1(TP)
RT2: C102.1 R92.2 S_RT2.1(TP)
RT3: C104.1 R93.2 S_RT3.1(TP)
NetC95_1: C95.1 D1.1(C) FB2.2 J3.2
NetC95_2: C95.2 D1.2(A) FB3.2 J3.1
NetC96_2: C96.2 U25.17(VCP)
NetC97_1: C97.1 R86.1 R90.1 RT1.2
NetC99_1: C99.1 R87.1 R91.1 RT2.2
NetC101_1: C101.1 R88.1 R92.1 RT3.2
NetC103_1: C103.1 R89.1 R93.1 RT4.2
NetFB2_1: FB2.1 U25.2(OUT1) U25.3(OUT1) U25.4(OUT1)
NetFB3_1: FB3.1 U25.21(OUT2) U25.22(OUT2) U25.23(OUT2)
NetR84_2: R84.2 U25.16(VPROPI)
NetR85_2: R85.2 U25.11(SR)

Not connected (* = marked no-connect by the designer): U25 14(LDOFB)* 15(LDOOUT)*

### Buses and harness runs
bus RT[0..3]

### Notes on the sheet
- Title
- Size:
- Date:
- A4

### Library data of the parts
C91-C93 = C_10UF_25V_X5R_0805_10: Ceramic Capacitor; Manufacturer Part Number: CL21A106KAYNNNE; Manufacturer: Samsung Electro-Mechanics; Value: 10uF; Tolerance: 10%; Part Number: C_10UF_25V_X5R_0805_10; Mount: Surface Mount; Height: 1.35mm; HelpURL: https://pl.mouser.com/datasheet/2/585/MLCC-1837944.pdf; RoHS: Compliant; Max Operating Temperature: 85°C; Status: MK; Supplier 1: Mouser; Supplier Part Number 1: 187-CL21A106KAYNNNE; Supplier 2: LCSC; Supplier Part Number 2: C15850; Manufacturer 2: Samsung Electro-Mechanics; Manufacturer Part Number 2: CL21A106KAYNNNE
C94 C96-C104 = C_100NF_16V_X5R_0402_10: as C82 on sheet ECL_Fanout_X3; Part Number: C_100NF_16V_X5R_0402_10; Mount: Surface Mount; Height: 500um; HelpURL: http://datasheet.octopart.com/EMK105BJ104KV-F-Taiyo-Yuden-datasheet-8857305.pdf; RoHS: Compliant; Max Operating Temperature: 125°C; Status: MK; Supplier 1: Mouser; Supplier Part Number 1: 963-EMK105BJ104KV-F; Manufacturer 2: Samsung Electro-Mechanics; Manufacturer Part Number 2: CL05B104KO5NNNC; Supplier 2: LCSC; Supplier Part Number 2: C1525
C95 = C_1NF_50V_C0G_0402_5: Ceramic Capacitor; Manufacturer Part Number: UMK105CG102JV-F; Manufacturer: Taiyo Yuden; Value: 1nF; Tolerance: 5%; Part Number: C_1NF_50V_C0G_0402_5; Mount: Surface Mount; Height: 500um; HelpURL: https://pl.mouser.com/datasheet/2/396/mlcc02_e-1307760.pdf; RoHS: Compliant; Max Operating Temperature: 125°C; Status: AK; Supplier 1: Mouser; Supplier Part Number 1: 963-JMK212ABJ106KG-T; Manufacturer 2: Guangdong Fenghua Advanced Tech; Manufacturer Part Number 2: 0402B102K500NT; Supplier 2: LCSC; Supplier Part Number 2: C1523
D1 = SMAJ5.0A-13-F: ESD Suppressors / TVS Diodes; Manufacturer: Diodes Inc; Max Power Dissipation: 400W; Direction: Unidirectional; Max Breakdown Voltage: 7.25V; Working Voltage: 5V; Min Breakdown Voltage: 6.4V; Box: 4; Part Number: SMAJ5.0A-13-F; Case/Package: DO-214AC; Manufacturer Part Number: SMAJ5.0A-13-F; Mount: Surface Mount; HelpURL: http://datasheet.octopart.com/SMAJ5.0A-13-F-Diodes-Inc.-datasheet-8324759.pdf; Max Operating Temperature: 150°C; RoHS: Compliant; Height: 2.42mm; Supplier 1: Mouser; Supplier Part Number 1: 621-SMAJ5.0A-13-F; Stock: 17
FB2 FB3 = FBMJ1608HS220NTR: Ferrite Bead; Manufacturer: Taiyo Yuden; Max Current Rating: 7.5A; Frequency: 100MHz; Impedance: 22; Tolerance: 30; DC Resistance (DCR): 4m; Part Number: FBMJ1608HS220NTR; Case/Package: 0603; Manufacturer Part Number: FBMJ1608HS220NTR; Height: 1mm; Mount: Surface Mount; Max Operating Temperature: 125; HelpURL: https://datasheet.octopart.com/FBMJ1608HS220NTR-Taiyo-Yuden-datasheet-17272614.pdf; RoHS: Compliant; Status: MK; Supplier 1: Mouser; Supplier Part Number 1: 963-FBMJ1608HS220NTR
J3 = 691101710002: PCB Terminal Block 1x2; Manufacturer: Wurth Elektronik; Pitch: 5mm; Gender: Receptacle; Box: A13; Part Number: 691101710002; Series: WR-TBL 101; Number of Rows: 1; Mount: Through Hole; Orientation: Horizontal; HelpURL: https://www.we-online.com/catalog/datasheet/691101710002.pdf; Max Operating Temperature: 105; Number of Pins: 2; RoHS: Compliant; Manufacturer Part Number: 691101710002; Status: MK; Supplier 1: Wurth Elektronik; Supplier Part Number 1: 691101710002; Stock: 50
R83 R86-R93 = R_10K_0402_1: as R39 on sheet Step_Gen; Part Number: R_10K_0402_1; Mount: Surface Mount; Height: 350um; HelpURL: https://pl.mouser.com/datasheet/2/447/PYu-RC_Group_51_RoHS_L_10-1664068.pdf; RoHS: Compliant; Max Operating Temperature: 155°C; Supplier 1: Mouser; Supplier Part Number 1: 603-RC0402FR-7W10KL; Manufacturer 2: Uniroyal Elec; Manufacturer Part Number 2: 0402WGF1002TCE; Supplier 2: LCSC; Supplier Part Number 2: C25744
R84 = R_1K5_0402_1: Thick Film Resistor; Manufacturer: Yageo; Manufacturer Part Number: RC0402FR-071K5L; Value: 1K5; Tolerance: 1%; Voltage Rating (DC): 50V; Power Rating: 63mW; Part Number: R_1K5_0402_1; Mount: Surface Mount; Height: 350um; HelpURL: https://pl.mouser.com/datasheet/2/447/PYu-RC_Group_51_RoHS_L_10-1527934.pdf; RoHS: Compliant; Max Operating Temperature: 155°C; Supplier 1: Mouser; Supplier Part Number 1: 603-RC0402FR-071K5L; Manufacturer 2: Uniroyal Elec; Manufacturer Part Number 2: 0402WGF1501TCE; Supplier 2: LCSC; Supplier Part Number 2: C25867
R85 = R_100K_0402_1: Thick Film Resistor; Manufacturer: Yageo; Manufacturer Part Number: RC0402FR-07100KL; Value: 100K; Tolerance: 1%; Voltage Rating (DC): 50V; Power Rating: 63mW; Stats: MK; Part Number: R_100K_0402_1; Mount: Surface Mount; Height: 350um; HelpURL: http://datasheet.octopart.com/RC0402FR-07100KL-Yageo-datasheet-127823281.pdf; RoHS: Compliant; Max Operating Temperature: 155°C; Supplier 1: Mouser; Supplier Part Number 1: 603-RC0402FR-07100KL; Manufacturer 2: Uniroyal Elec; Manufacturer Part Number 2: 0402WGF1003TCE; Supplier 2: LCSC; Supplier Part Number 2: C25741
RT1-RT4 = NCP15XH103J03RC: NTC Thermistor; Manufacturer: Murata; Output Current: 310uA; Output Type: Analog Voltage; Accuracy: 0.7%; Sensor Type: Temperature; Box: 257; Part Number: NCP15XH103J03RC; Manufacturer Part Number: NCP15XH103J03RC; Case/Package: 0402; Mount: Surface Mount; Height: 0.5mm; HelpURL: http://datasheet.octopart.com/NCP15XH103J03RC-Murata-datasheet-11547476.pdf; Max Operating Temperature: 125°C; RoHS: Compliant; Status: MK; Supplier 1: Mouser; Supplier Part Number 1: 81-NCP15XH103J03RC; Stock: 38
S_RT0-S_RT3 = TP_PAD_1.3MM: Testpoint SMD 1.3mm; Part Number: TP_PAD_1.3MM; Case/Package: SMD; Length: 0mm
U25 = DRV8850RGYR: Low Voltage H-Bridge IC With LDO Voltage Regulator; Manufacturer: Texas Instruments; Output Current: 5A; Max Output Current: 9.5A; Number of Outputs: 1; Interface: Paralell; Switching Frequency: 50KHz; Max Supply Voltage: 5.5V; Min Supply Voltage: 2V; Manufacturer Part Number: DRV8850RGYR; Part Number: DRV8850RGYR; Mount: Surface Mount; HelpURL: https://www.ti.com/lit/ds/symlink/drv8850.pdf; Marking: DRV8850; Max Operating Temperature: 85°C; Height: 1mm; RoHS: Compliant; Supplier 1: Mouser; Supplier Part Number 1: 595-DRV8850RGYR

## Sheet ECL_Fanout_X2.SchDoc
size A4; ApprovedBy: Mateusz Kowalik; CheckedBy: Mateusz Kowalik; Author: Mateusz Kowalik; CompanyName: InMotion Labs sp. z o.o.; DrawnBy: Mateusz Kowalik; Engineer: Mateusz Kowalik; Organization: InMotion Labs sp. z o.o.; Address1: Rydlówka 5A; Address2: 30-363 Kraków; Address4: Poland; DocumentNumber: 16; Revision: Rev 0; SheetNumber: 16; SheetTotal: 17
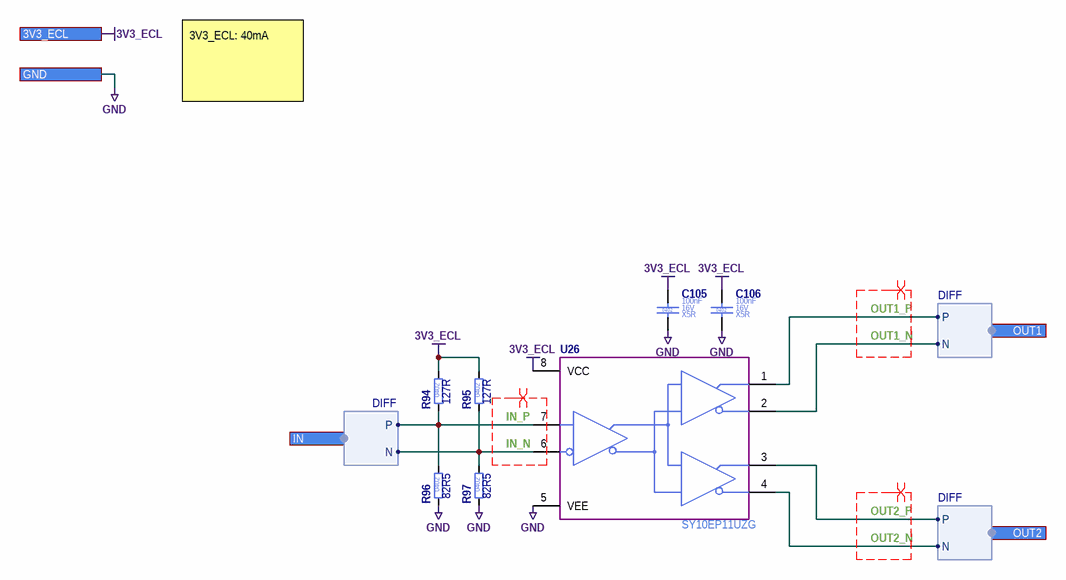
[diagram p16: ECL_Fanout_X2.SchDoc]

### Parts
C105  Case/Package: 0402  Voltage Rating (DC): 16V  Dielectric: X5R  Capacitance: 100nF  [C_0402_1005]  (hidden comment: C_100NF_16V_X5R_0402_10)
C106  Case/Package: 0402  Voltage Rating (DC): 16V  Dielectric: X5R  Capacitance: 100nF  [C_0402_1005]  (hidden comment: C_100NF_16V_X5R_0402_10)
R94  Resistance: 127R  Case/Package: 0402  [R_0402_1005]  (hidden comment: R_127R_0402_1)
R95  Resistance: 127R  Case/Package: 0402  [R_0402_1005]  (hidden comment: R_127R_0402_1)
R96  Resistance: 82R5  Case/Package: 0402  [R_0402_1005]  (hidden comment: R_82R5_0402_1)
R97  Resistance: 82R5  Case/Package: 0402  [R_0402_1005]  (hidden comment: R_82R5_0402_1)
U26  SY10EP11UZG  [SOIC127P600X170-8N]

### Ports
3V3_ECL, GND, IN (harness DIFF), OUT1 (harness DIFF), OUT2 (harness DIFF)

### Harnesses
DIFF: P, N

### Nets
3V3_ECL: C105.1 C106.1 R94.2 R95.2 U26.8(VCC) ; port 3V3_ECL
GND: C105.2 C106.2 R96.1 R97.1 U26.5(VEE) ; port GND
IN_N: R95.1 R97.2 U26.6(~{D}) ; port IN.N
IN_P: R94.1 R96.2 U26.7(D) ; port IN.P
OUT1_N: U26.2(/Q0) ; port OUT1.N  [project net IN_N]
OUT1_P: U26.1(Q0) ; port OUT1.P  [project net IN_P]
OUT2_N: U26.4(~{Q1}) ; port OUT2.N  [project net IN_N]
OUT2_P: U26.3(Q1) ; port OUT2.P  [project net IN_P]

### Layout directives
differential pair; differential pair class D100; net class D100: IN_N, IN_P, OUT1_N, OUT1_P, OUT2_N, OUT2_P

### Notes on the sheet
- 3V3_ECL: 40mA
- Title
- Size:
- Date:
- A4

### Library data of the parts
C105 C106 = C_100NF_16V_X5R_0402_10: as C82 on sheet ECL_Fanout_X3; Part Number: C_100NF_16V_X5R_0402_10; Mount: Surface Mount; Height: 500um; HelpURL: http://datasheet.octopart.com/EMK105BJ104KV-F-Taiyo-Yuden-datasheet-8857305.pdf; RoHS: Compliant; Max Operating Temperature: 125°C; Status: MK; Supplier 1: Mouser; Supplier Part Number 1: 963-EMK105BJ104KV-F; Manufacturer 2: Samsung Electro-Mechanics; Manufacturer Part Number 2: CL05B104KO5NNNC; Supplier 2: LCSC; Supplier Part Number 2: C1525
R94 R95 = R_127R_0402_1: as R48 on sheet ECL_Fanout_X3; Part Number: R_127R_0402_1; Mount: Surface Mount; Height: 350um; HelpURL: https://pl.mouser.com/datasheet/2/447/PYu_RC_Group_51_RoHS_L_10-1664068.pdf; RoHS: Compliant; Max Operating Temperature: 155°C; Supplier 1: Mouser; Supplier Part Number 1: 603-RC0402FR-07127RL; Manufacturer 2: Uniroyal Elec; Manufacturer Part Number 2: 0402WGF1270TCE; Supplier 2: LCSC; Supplier Part Number 2: C247127
R96 R97 = R_82R5_0402_1: as R52 on sheet ECL_Fanout_X3; Part Number: R_82R5_0402_1; Mount: Surface Mount; Height: 350um; HelpURL: https://pl.mouser.com/datasheet/2/447/PYu-RC_Group_51_RoHS_L_10-1527934.pdf; RoHS: Compliant; Max Operating Temperature: 155°C; Supplier 1: Mouser; Supplier Part Number 1: 603-RC0402FR-0782R5L; Manufacturer 2: Uniroyal Elec; Manufacturer Part Number 2: 0402WGF825JTCE; Supplier 2: LCSC; Supplier Part Number 2: C52037
U26 = SY10EP11UZG: as U18 on sheet ECL_Fanout_X3; Part Number: SY10EP11UZG; Case/Package: SOIC8; Mount: Surface Mount; Height: 1.75mm; HelpURL: https://datasheet.octopart.com/SY10EP11UZG-Microchip-datasheet-39498.pdf; Max Operating Temperature: 85°C; RoHS: Compliant; Status: MK; Manufacturer Part Number: SY10EP11UZG; Supplier 1: Mouser; Supplier Part Number 1: 998-SY10EP11UZG